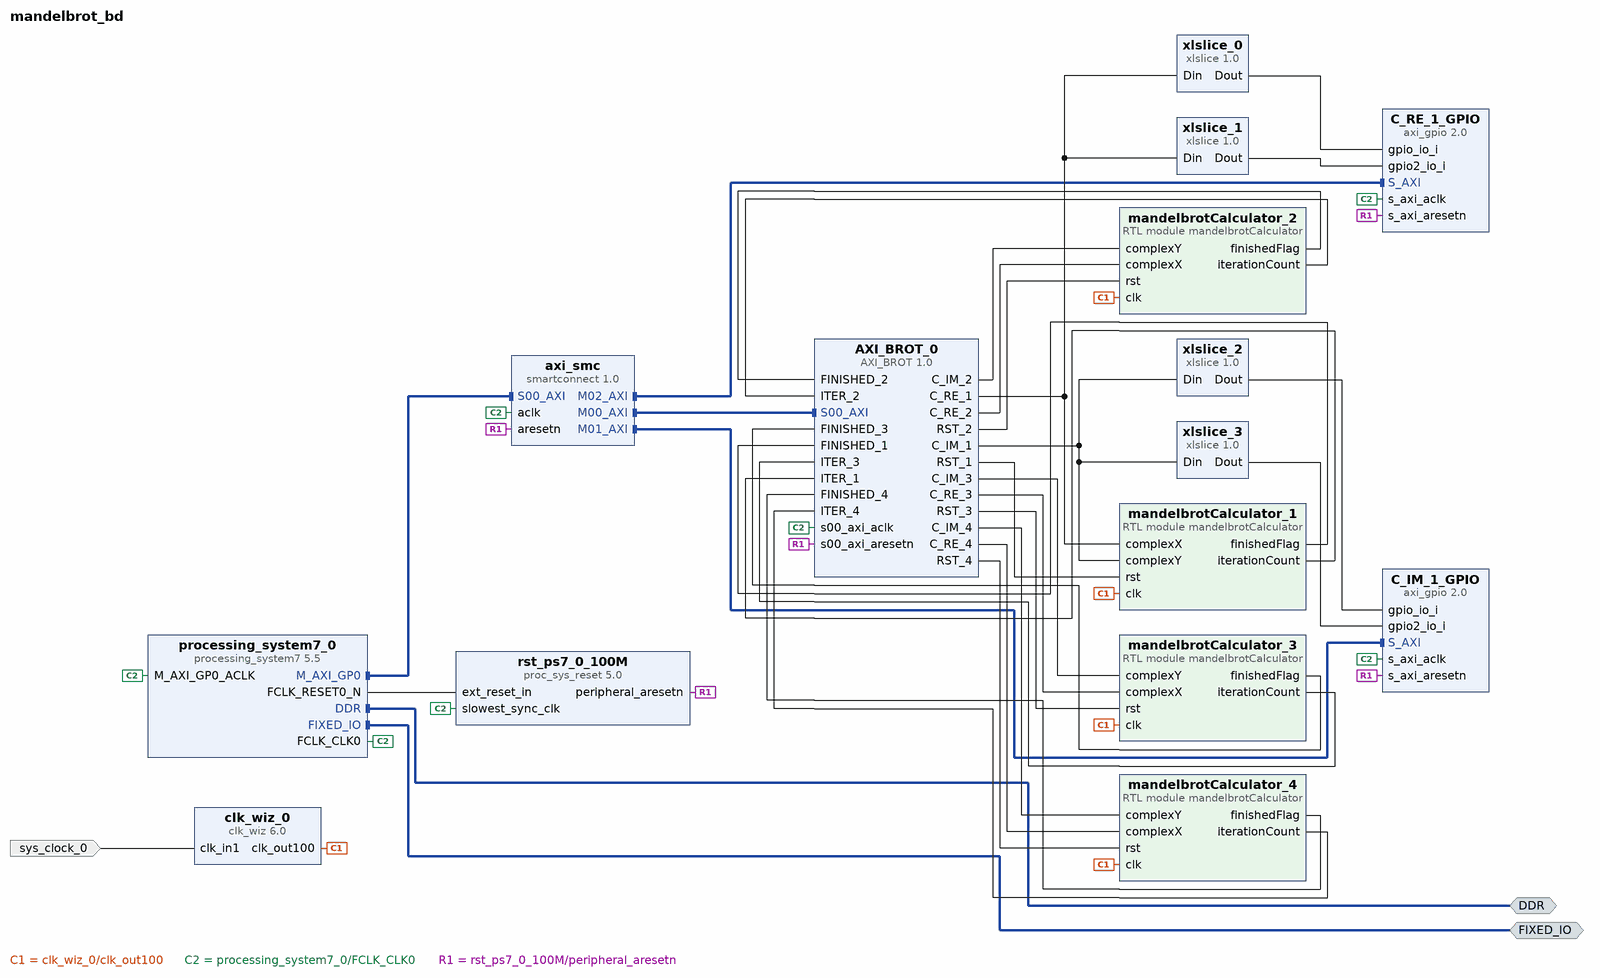
[diagram p0: block diagram of the top level]
# Vivado block design mandelbrot_bd, xc7z020clg400-1, Vivado 2025.1
create_bd_design mandelbrot_bd

create_bd_intf_port -mode Master -vlnv xilinx.com:interface:ddrx_rtl:1.0 DDR
create_bd_intf_port -mode Master -vlnv xilinx.com:display_processing_system7:fixedio_rtl:1.0 FIXED_IO
create_bd_port -dir I -type clk sys_clock_0
set_property -dict {CONFIG.FREQ_HZ 125000000 CONFIG.PHASE 0.0} [get_bd_ports sys_clock_0]

create_bd_cell -type ip -vlnv xilinx.com:ip:processing_system7:5.5 processing_system7_0
set_property -dict [list \
  CONFIG.PCW_APU_PERIPHERAL_FREQMHZ 650 \
  CONFIG.PCW_CRYSTAL_PERIPHERAL_FREQMHZ 50 \
  CONFIG.PCW_ENET0_ENET0_IO {MIO 16 .. 27} \
  CONFIG.PCW_ENET0_GRP_MDIO_ENABLE 1 \
  CONFIG.PCW_ENET0_GRP_MDIO_IO {MIO 52 .. 53} \
  CONFIG.PCW_ENET0_PERIPHERAL_ENABLE 1 \
  CONFIG.PCW_ENET0_RESET_ENABLE 1 \
  CONFIG.PCW_ENET0_RESET_IO {MIO 9} \
  CONFIG.PCW_ENET_RESET_ENABLE 1 \
  CONFIG.PCW_ENET_RESET_SELECT {Share reset pin} \
  CONFIG.PCW_FPGA0_PERIPHERAL_FREQMHZ 100 \
  CONFIG.PCW_FPGA1_PERIPHERAL_FREQMHZ 50 \
  CONFIG.PCW_GPIO_MIO_GPIO_ENABLE 1 \
  CONFIG.PCW_GPIO_MIO_GPIO_IO MIO \
  CONFIG.PCW_I2C_RESET_ENABLE 1 \
  CONFIG.PCW_M_AXI_GP0_FREQMHZ 10 \
  CONFIG.PCW_PERIPHERAL_BOARD_PRESET None \
  CONFIG.PCW_PRESET_BANK1_VOLTAGE {LVCMOS 1.8V} \
  CONFIG.PCW_QSPI_GRP_FBCLK_ENABLE 1 \
  CONFIG.PCW_QSPI_GRP_FBCLK_IO {MIO 8} \
  CONFIG.PCW_QSPI_GRP_SINGLE_SS_ENABLE 1 \
  CONFIG.PCW_QSPI_GRP_SINGLE_SS_IO {MIO 1 .. 6} \
  CONFIG.PCW_QSPI_PERIPHERAL_ENABLE 1 \
  CONFIG.PCW_QSPI_QSPI_IO {MIO 1 .. 6} \
  CONFIG.PCW_SD0_GRP_CD_ENABLE 1 \
  CONFIG.PCW_SD0_GRP_CD_IO {MIO 47} \
  CONFIG.PCW_SD0_GRP_WP_ENABLE 0 \
  CONFIG.PCW_SD0_PERIPHERAL_ENABLE 1 \
  CONFIG.PCW_SD0_SD0_IO {MIO 40 .. 45} \
  CONFIG.PCW_SDIO_PERIPHERAL_FREQMHZ 50 \
  CONFIG.PCW_SINGLE_QSPI_DATA_MODE x4 \
  CONFIG.PCW_TTC0_PERIPHERAL_ENABLE 1 \
  CONFIG.PCW_TTC0_TTC0_IO EMIO \
  CONFIG.PCW_UART0_PERIPHERAL_ENABLE 1 \
  CONFIG.PCW_UART0_UART0_IO {MIO 14 .. 15} \
  CONFIG.PCW_UART1_PERIPHERAL_ENABLE 0 \
  CONFIG.PCW_UART_PERIPHERAL_FREQMHZ 100 \
  CONFIG.PCW_UIPARAM_DDR_BUS_WIDTH {16 Bit} \
  CONFIG.PCW_UIPARAM_DDR_FREQ_MHZ 525 \
  CONFIG.PCW_UIPARAM_DDR_PARTNO {MT41J256M16 RE-125} \
  CONFIG.PCW_USB0_PERIPHERAL_ENABLE 1 \
  CONFIG.PCW_USB0_RESET_ENABLE 1 \
  CONFIG.PCW_USB0_RESET_IO {MIO 46} \
  CONFIG.PCW_USB0_USB0_IO {MIO 28 .. 39} \
  CONFIG.PCW_USB_RESET_ENABLE 1 \
  CONFIG.PCW_USB_RESET_SELECT {Share reset pin} \
] [get_bd_cells processing_system7_0]
# 482 more settings of processing_system7_0 are not shown: defaults, MIO pin electricals, DDR timing, and values the tool derives
create_bd_cell -type ip -vlnv xilinx.com:ip:proc_sys_reset:5.0 rst_ps7_0_100M
create_bd_cell -type module -reference mandelbrotCalculator mandelbrotCalculator_4
create_bd_cell -type module -reference mandelbrotCalculator mandelbrotCalculator_1
create_bd_cell -type module -reference mandelbrotCalculator mandelbrotCalculator_2
create_bd_cell -type module -reference mandelbrotCalculator mandelbrotCalculator_3
create_bd_cell -type ip -vlnv xilinx.com:ip:clk_wiz:6.0 clk_wiz_0
set_property -dict [list \
  CONFIG.CLKIN1_JITTER_PS 80.0 \
  CONFIG.CLKOUT1_JITTER 124.615 \
  CONFIG.CLKOUT1_PHASE_ERROR 96.948 \
  CONFIG.CLKOUT1_REQUESTED_OUT_FREQ 100.000 \
  CONFIG.CLK_IN1_BOARD_INTERFACE sys_clock \
  CONFIG.CLK_OUT1_PORT clk_out100 \
  CONFIG.MMCM_CLKFBOUT_MULT_F 8.000 \
  CONFIG.MMCM_CLKIN1_PERIOD 8.000 \
  CONFIG.MMCM_CLKOUT0_DIVIDE_F 10.000 \
  CONFIG.USE_BOARD_FLOW true \
  CONFIG.USE_LOCKED false \
  CONFIG.USE_RESET false \
] [get_bd_cells clk_wiz_0]
create_bd_cell -type ip -vlnv xilinx.com:ip:smartconnect:1.0 axi_smc
set_property -dict {CONFIG.NUM_MI 3 CONFIG.NUM_SI 1} [get_bd_cells axi_smc]
create_bd_cell -type ip -vlnv xilinx.com:user:AXI_BROT:1.0 AXI_BROT_0
create_bd_cell -type ip -vlnv xilinx.com:ip:axi_gpio:2.0 C_RE_1_GPIO
set_property -dict {CONFIG.C_ALL_INPUTS 1 CONFIG.C_ALL_INPUTS_2 1 CONFIG.C_IS_DUAL 1} [get_bd_cells C_RE_1_GPIO]
create_bd_cell -type ip -vlnv xilinx.com:ip:xlslice:1.0 xlslice_0
set_property -dict {CONFIG.DIN_FROM 63 CONFIG.DIN_TO 32 CONFIG.DIN_WIDTH 64} [get_bd_cells xlslice_0]
create_bd_cell -type ip -vlnv xilinx.com:ip:xlslice:1.0 xlslice_1
set_property -dict {CONFIG.DIN_FROM 31 CONFIG.DIN_TO 0 CONFIG.DIN_WIDTH 64} [get_bd_cells xlslice_1]
create_bd_cell -type ip -vlnv xilinx.com:ip:axi_gpio:2.0 C_IM_1_GPIO
set_property -dict {CONFIG.C_ALL_INPUTS 1 CONFIG.C_ALL_INPUTS_2 1 CONFIG.C_IS_DUAL 1} [get_bd_cells C_IM_1_GPIO]
create_bd_cell -type ip -vlnv xilinx.com:ip:xlslice:1.0 xlslice_2
set_property -dict {CONFIG.DIN_FROM 63 CONFIG.DIN_TO 32 CONFIG.DIN_WIDTH 64} [get_bd_cells xlslice_2]
create_bd_cell -type ip -vlnv xilinx.com:ip:xlslice:1.0 xlslice_3
set_property -dict {CONFIG.DIN_FROM 31 CONFIG.DIN_TO 0 CONFIG.DIN_WIDTH 64} [get_bd_cells xlslice_3]

# ---- connections ----

connect_bd_intf_net [get_bd_intf_pins axi_smc/M00_AXI] [get_bd_intf_pins AXI_BROT_0/S00_AXI]
connect_bd_intf_net [get_bd_intf_pins axi_smc/M01_AXI] [get_bd_intf_pins C_IM_1_GPIO/S_AXI]
connect_bd_intf_net [get_bd_intf_pins axi_smc/M02_AXI] [get_bd_intf_pins C_RE_1_GPIO/S_AXI]
connect_bd_intf_net [get_bd_intf_ports DDR] [get_bd_intf_pins processing_system7_0/DDR]
connect_bd_intf_net [get_bd_intf_ports FIXED_IO] [get_bd_intf_pins processing_system7_0/FIXED_IO]
connect_bd_intf_net [get_bd_intf_pins processing_system7_0/M_AXI_GP0] [get_bd_intf_pins axi_smc/S00_AXI]
connect_bd_net [get_bd_pins AXI_BROT_0/C_IM_1] [get_bd_pins mandelbrotCalculator_1/complexY] [get_bd_pins xlslice_2/Din] [get_bd_pins xlslice_3/Din]
connect_bd_net [get_bd_pins AXI_BROT_0/C_IM_2] [get_bd_pins mandelbrotCalculator_2/complexY]
connect_bd_net [get_bd_pins AXI_BROT_0/C_IM_3] [get_bd_pins mandelbrotCalculator_3/complexY]
connect_bd_net [get_bd_pins AXI_BROT_0/C_IM_4] [get_bd_pins mandelbrotCalculator_4/complexY]
connect_bd_net [get_bd_pins AXI_BROT_0/C_RE_1] [get_bd_pins mandelbrotCalculator_1/complexX] [get_bd_pins xlslice_0/Din] [get_bd_pins xlslice_1/Din]
connect_bd_net [get_bd_pins AXI_BROT_0/C_RE_2] [get_bd_pins mandelbrotCalculator_2/complexX]
connect_bd_net [get_bd_pins AXI_BROT_0/C_RE_3] [get_bd_pins mandelbrotCalculator_3/complexX]
connect_bd_net [get_bd_pins AXI_BROT_0/C_RE_4] [get_bd_pins mandelbrotCalculator_4/complexX]
connect_bd_net [get_bd_pins AXI_BROT_0/RST_1] [get_bd_pins mandelbrotCalculator_1/rst]
connect_bd_net [get_bd_pins AXI_BROT_0/RST_2] [get_bd_pins mandelbrotCalculator_2/rst]
connect_bd_net [get_bd_pins AXI_BROT_0/RST_3] [get_bd_pins mandelbrotCalculator_3/rst]
connect_bd_net [get_bd_pins AXI_BROT_0/RST_4] [get_bd_pins mandelbrotCalculator_4/rst]
connect_bd_net [get_bd_pins clk_wiz_0/clk_out100] \
  [get_bd_pins mandelbrotCalculator_4/clk] [get_bd_pins mandelbrotCalculator_1/clk] [get_bd_pins mandelbrotCalculator_2/clk] \
  [get_bd_pins mandelbrotCalculator_3/clk]
connect_bd_net [get_bd_pins mandelbrotCalculator_1/finishedFlag] [get_bd_pins AXI_BROT_0/FINISHED_1]
connect_bd_net [get_bd_pins mandelbrotCalculator_1/iterationCount] [get_bd_pins AXI_BROT_0/ITER_1]
connect_bd_net [get_bd_pins mandelbrotCalculator_2/finishedFlag] [get_bd_pins AXI_BROT_0/FINISHED_2]
connect_bd_net [get_bd_pins mandelbrotCalculator_2/iterationCount] [get_bd_pins AXI_BROT_0/ITER_2]
connect_bd_net [get_bd_pins mandelbrotCalculator_3/finishedFlag] [get_bd_pins AXI_BROT_0/FINISHED_3]
connect_bd_net [get_bd_pins mandelbrotCalculator_3/iterationCount] [get_bd_pins AXI_BROT_0/ITER_3]
connect_bd_net [get_bd_pins mandelbrotCalculator_4/finishedFlag] [get_bd_pins AXI_BROT_0/FINISHED_4]
connect_bd_net [get_bd_pins mandelbrotCalculator_4/iterationCount] [get_bd_pins AXI_BROT_0/ITER_4]
connect_bd_net [get_bd_pins processing_system7_0/FCLK_CLK0] \
  [get_bd_pins axi_smc/aclk] [get_bd_pins processing_system7_0/M_AXI_GP0_ACLK] [get_bd_pins rst_ps7_0_100M/slowest_sync_clk] \
  [get_bd_pins AXI_BROT_0/s00_axi_aclk] [get_bd_pins C_IM_1_GPIO/s_axi_aclk] [get_bd_pins C_RE_1_GPIO/s_axi_aclk]
connect_bd_net [get_bd_pins processing_system7_0/FCLK_RESET0_N] [get_bd_pins rst_ps7_0_100M/ext_reset_in]
connect_bd_net [get_bd_pins rst_ps7_0_100M/peripheral_aresetn] \
  [get_bd_pins axi_smc/aresetn] [get_bd_pins AXI_BROT_0/s00_axi_aresetn] [get_bd_pins C_IM_1_GPIO/s_axi_aresetn] \
  [get_bd_pins C_RE_1_GPIO/s_axi_aresetn]
connect_bd_net -net sys_clock_0_1 [get_bd_ports sys_clock_0] [get_bd_pins clk_wiz_0/clk_in1]
connect_bd_net [get_bd_pins xlslice_0/Dout] [get_bd_pins C_RE_1_GPIO/gpio_io_i]
connect_bd_net [get_bd_pins xlslice_1/Dout] [get_bd_pins C_RE_1_GPIO/gpio2_io_i]
connect_bd_net [get_bd_pins xlslice_2/Dout] [get_bd_pins C_IM_1_GPIO/gpio_io_i]
connect_bd_net [get_bd_pins xlslice_3/Dout] [get_bd_pins C_IM_1_GPIO/gpio2_io_i]

# ---- address map ----
assign_bd_address -offset 0x41200000 -range 64K -target_address_space [get_bd_addr_spaces processing_system7_0/Data] [get_bd_addr_segs C_IM_1_GPIO/S_AXI/Reg]
assign_bd_address -offset 0x41210000 -range 64K -target_address_space [get_bd_addr_spaces processing_system7_0/Data] [get_bd_addr_segs C_RE_1_GPIO/S_AXI/Reg]
assign_bd_address -offset 0x43C00000 -range 64K -target_address_space [get_bd_addr_spaces processing_system7_0/Data] [get_bd_addr_segs AXI_BROT_0/S00_AXI/S00_AXI_reg]

validate_bd_design
save_bd_design
